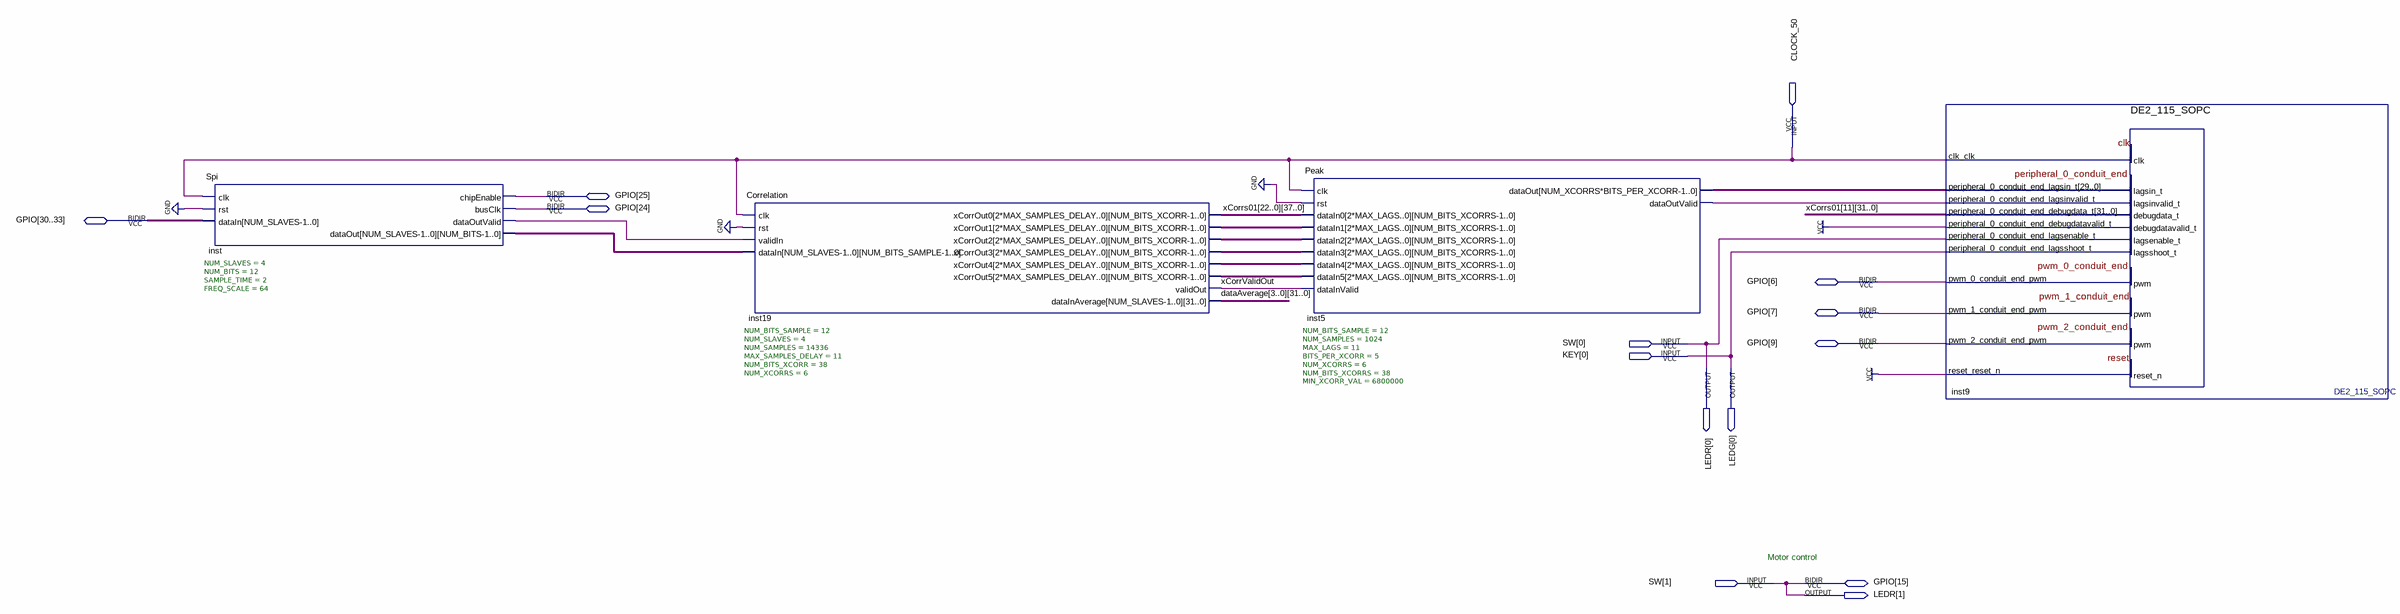
[diagram p0: schematic sheet]
// Quartus schematic Lab7.bdf as structural Verilog: 4 symbols, 14 pins
module Lab7 (
  input  CLOCK_50,
  input  [1:0] SW,
  input  [0:0] KEY,
  inout  [6:33] GPIO,
  output [1:0] LEDR,
  output [0:0] LEDG
);

  wire inst5_dataoutvalid, inst_dataoutvalid, xCorrValidOut;
  wire [29:0] inst5_dataout;
  wire [31:0] dataAverage_0, dataAverage_1, dataAverage_2, dataAverage_3;
  wire [37:0] xCorrs01_0, xCorrs01_1, xCorrs01_2, xCorrs01_3, xCorrs01_4, xCorrs01_5, xCorrs01_6, xCorrs01_7,
       xCorrs01_8, xCorrs01_9, xCorrs01_10, xCorrs01_11, xCorrs01_12, xCorrs01_13, xCorrs01_14, xCorrs01_15,
       xCorrs01_16, xCorrs01_17, xCorrs01_18, xCorrs01_19, xCorrs01_20, xCorrs01_21, xCorrs01_22;
  wire [47:0] inst_dataout;
  wire [873:0] inst19_xcorrout1, inst19_xcorrout2, inst19_xcorrout3, inst19_xcorrout4, inst19_xcorrout5;

  Spi #(.NUM_SLAVES(4), .NUM_BITS(12), .SAMPLE_TIME(2), .FREQ_SCALE(64)) inst (
    .clk(CLOCK_50), .rst(1'b0), .dataIn(GPIO[30:33]), .chipEnable(GPIO[25]), .busClk(GPIO[24]),
    .dataOutValid(inst_dataoutvalid), .dataOut(inst_dataout));
  Correlation #(.NUM_BITS_SAMPLE(12), .NUM_SLAVES(4), .NUM_SAMPLES(14336), .MAX_SAMPLES_DELAY(11), .NUM_BITS_XCORR(38), .NUM_XCORRS(6)) inst19 (
    .clk(CLOCK_50), .rst(1'b0), .validIn(inst_dataoutvalid), .dataIn(inst_dataout), .validOut(xCorrValidOut),
    .xCorrOut0({xCorrs01_22, xCorrs01_21, xCorrs01_20, xCorrs01_19, xCorrs01_18, xCorrs01_17, xCorrs01_16, xCorrs01_15, xCorrs01_14, xCorrs01_13, xCorrs01_12, xCorrs01_11, xCorrs01_10, xCorrs01_9, xCorrs01_8, xCorrs01_7, xCorrs01_6, xCorrs01_5, xCorrs01_4, xCorrs01_3, xCorrs01_2, xCorrs01_1, xCorrs01_0}),
    .xCorrOut1(inst19_xcorrout1), .xCorrOut2(inst19_xcorrout2), .xCorrOut3(inst19_xcorrout3),
    .xCorrOut4(inst19_xcorrout4), .xCorrOut5(inst19_xcorrout5),
    .dataInAverage({dataAverage_3, dataAverage_2, dataAverage_1, dataAverage_0}));
  Peak #(.NUM_BITS_SAMPLE(12), .NUM_SAMPLES(1024), .MAX_LAGS(11), .BITS_PER_XCORR(5), .NUM_XCORRS(6), .NUM_BITS_XCORRS(38), .MIN_XCORR_VAL(6800000)) inst5 (
    .clk(CLOCK_50), .rst(1'b0),
    .dataIn0({xCorrs01_22, xCorrs01_21, xCorrs01_20, xCorrs01_19, xCorrs01_18, xCorrs01_17, xCorrs01_16, xCorrs01_15, xCorrs01_14, xCorrs01_13, xCorrs01_12, xCorrs01_11, xCorrs01_10, xCorrs01_9, xCorrs01_8, xCorrs01_7, xCorrs01_6, xCorrs01_5, xCorrs01_4, xCorrs01_3, xCorrs01_2, xCorrs01_1, xCorrs01_0}),
    .dataIn1(inst19_xcorrout1), .dataIn2(inst19_xcorrout2), .dataIn3(inst19_xcorrout3),
    .dataIn4(inst19_xcorrout4), .dataIn5(inst19_xcorrout5), .dataInValid(xCorrValidOut),
    .dataOut(inst5_dataout), .dataOutValid(inst5_dataoutvalid));
  DE2_115_SOPC inst9 (
    .clk_clk(CLOCK_50), .peripheral_0_conduit_end_lagsin_t(inst5_dataout),
    .peripheral_0_conduit_end_lagsinvalid_t(inst5_dataoutvalid),
    .peripheral_0_conduit_end_debugdata_t(xCorrs01_11[31:0]),
    .peripheral_0_conduit_end_debugdatavalid_t(1'b1), .peripheral_0_conduit_end_lagsenable_t(SW[0]),
    .peripheral_0_conduit_end_lagsshoot_t(KEY[0]), .reset_reset_n(1'b1), .pwm_0_conduit_end_pwm(GPIO[6]),
    .pwm_1_conduit_end_pwm(GPIO[7]), .pwm_2_conduit_end_pwm(GPIO[9]));

  assign GPIO[15] = SW[1];
  assign LEDG[0] = KEY[0];
  assign LEDR = SW;

  // Notes on the sheet:
  //   Motor control
endmodule
